# EasyEDA schematic SCH_Tiny_printer_small_2024-12-05.json
TITLE: TinyGB Printer; REV: 1.0; Date: 2024-09-05; Sheet: 1/1; Drawn By: raphael.boichot; Company: Raphaël BOICHOT
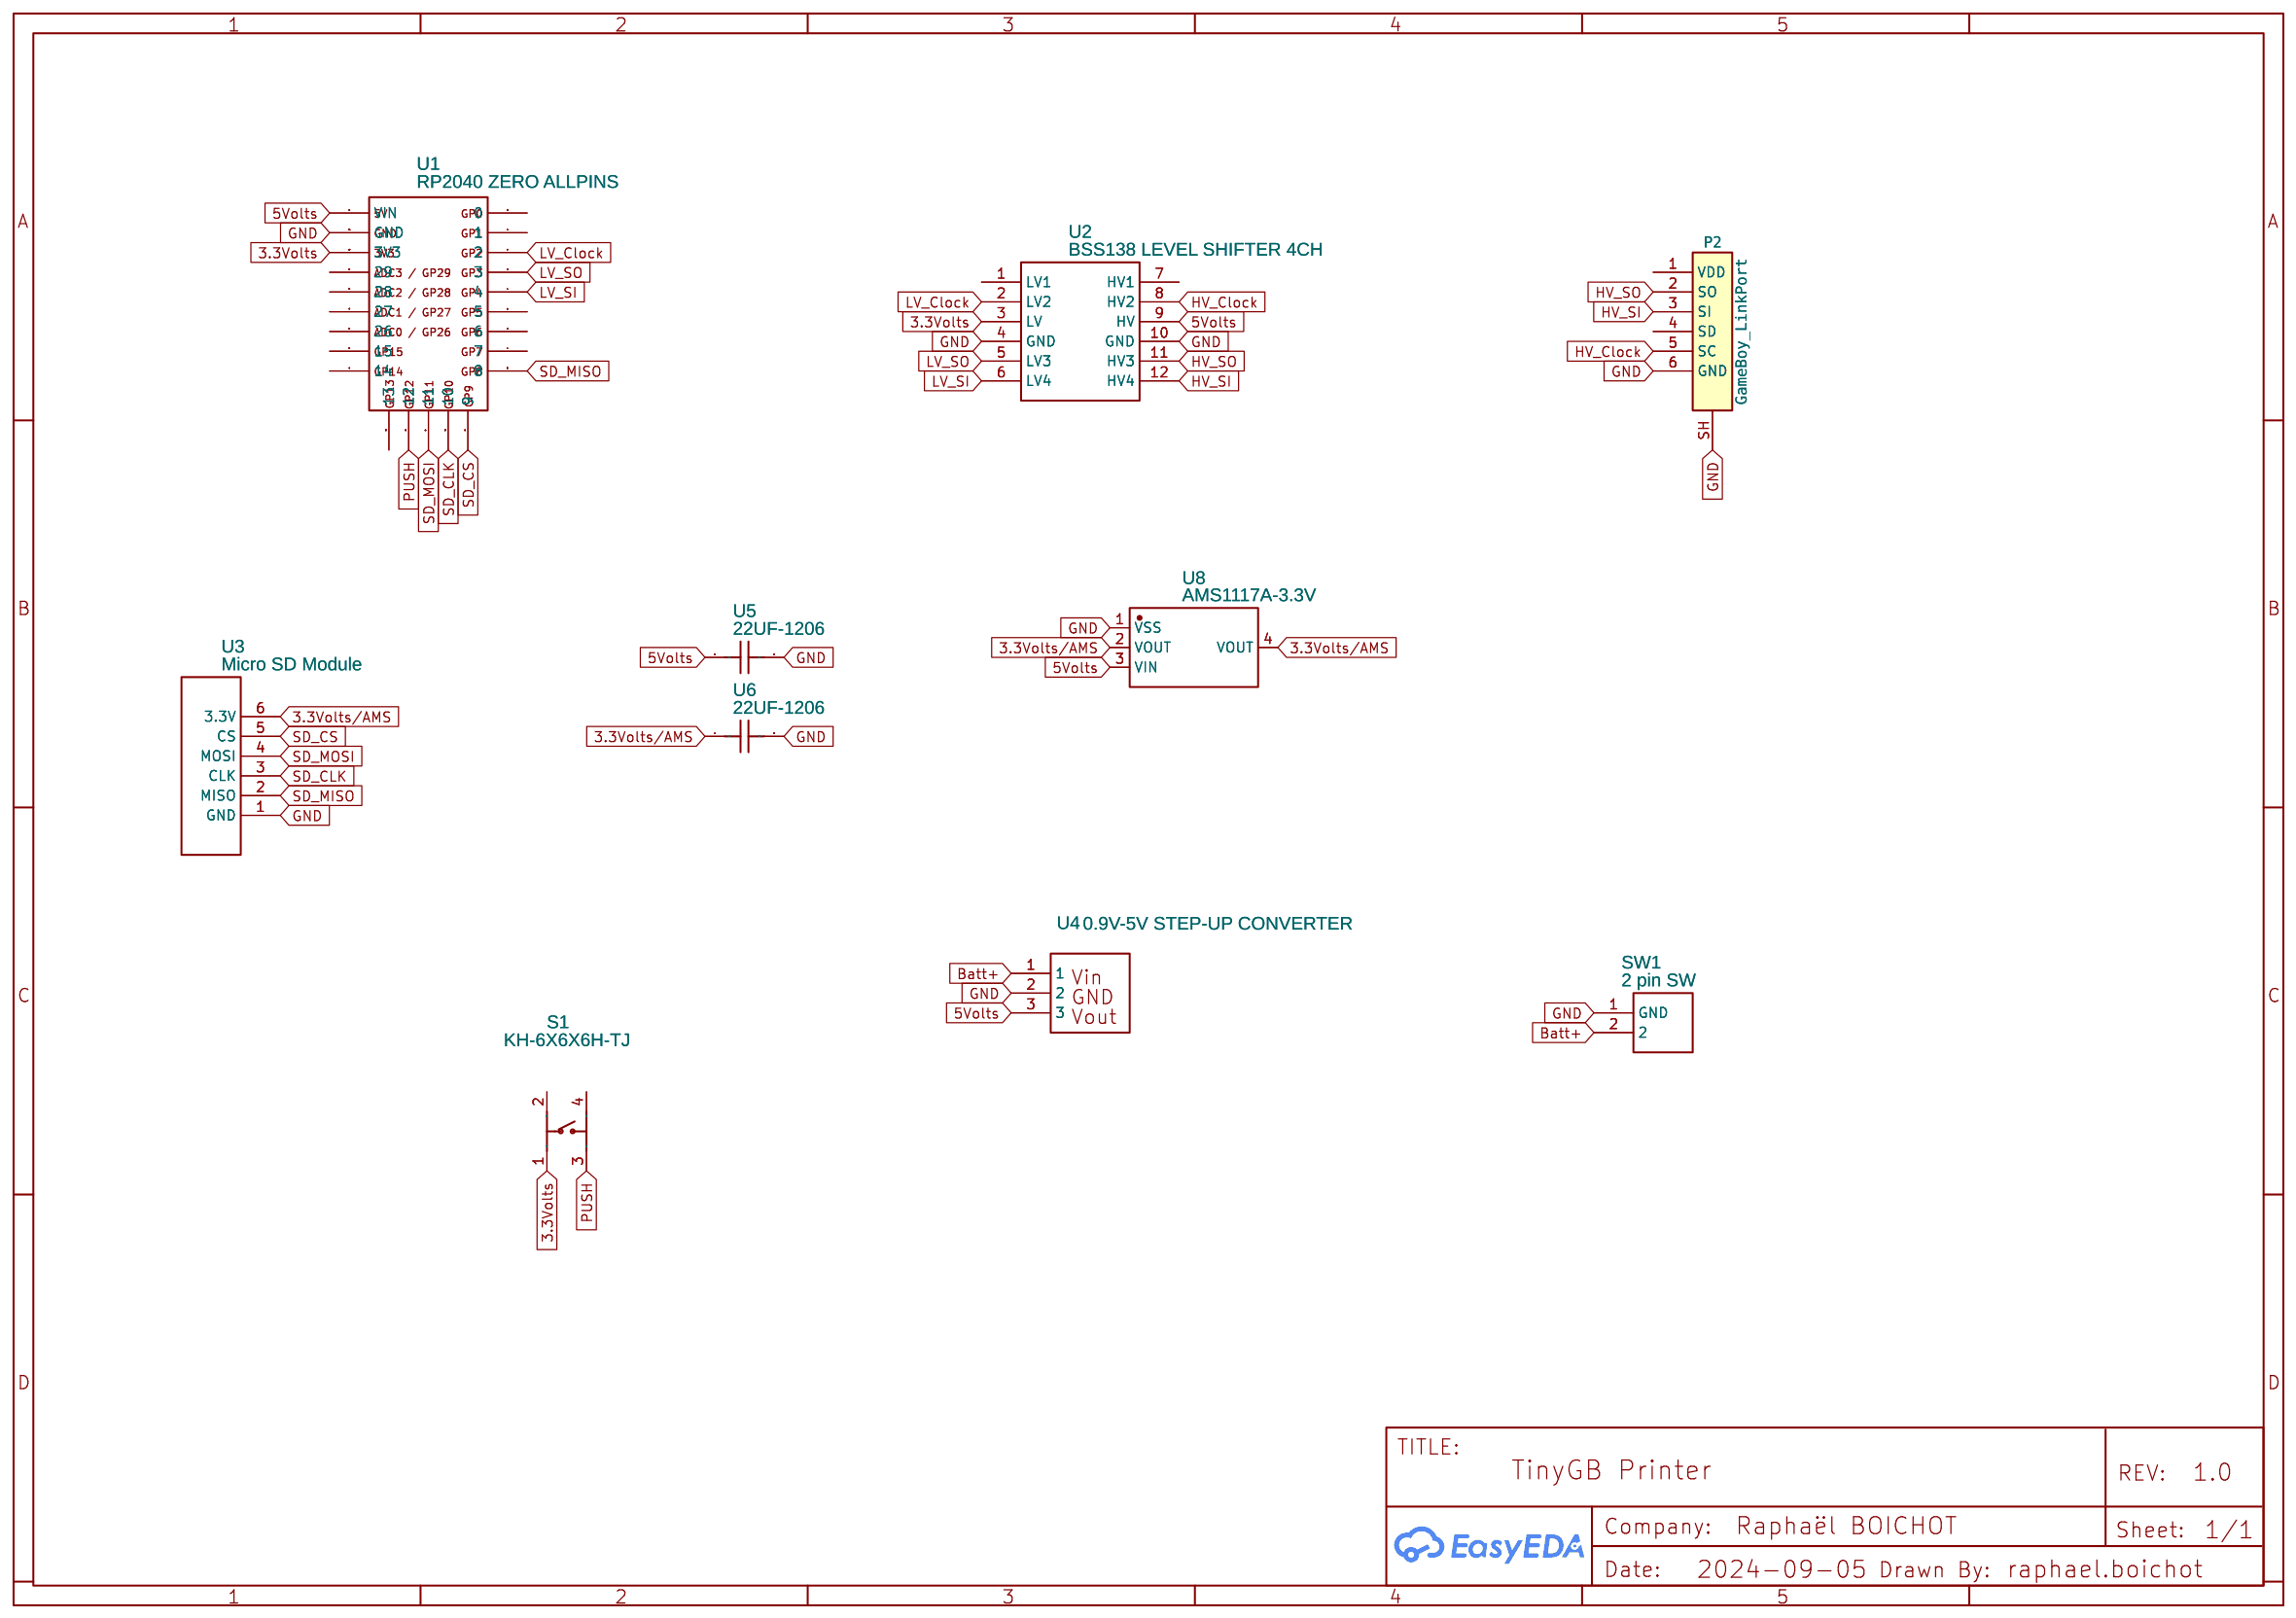
[diagram p0: schematic sheet]

## Parts
P2  GameBoy_LinkPort  [GAMEBOY_LINKPORT_MGB_HORIZONTAL]
S1  KH-6X6X6H-TJ  [SW-TH_4P-L6.0-W6.0-P4.50-LS6.5]
SW1  2 pin SW  [2PINSW]
U1  RP2040 ZERO ALLPINS  [RP2040-ZERO-ALLPINS]
U2  BSS138 LEVEL SHIFTER 4CH  [PKG-BSS138-LEVEL-SHIFTER]
U3  Micro SD Module  [MICRO SD CARD]
U4  0.9V-5V STEP-UP CONVERTER  [0.9V-5V STEP-UP CONVERTER]
U5  22UF-1206  [C1206]
U6  22UF-1206  [C1206]
U8  AMS1117A-3.3V  [SOT-223_L6.3-W3.5-P2.30-LS7.0-BR]

## Library data of the parts
S1 = KH-6X6X6H-TJ: Supplier: LCSC; Supplier Part: C2837516; Manufacturer: kinghelm(金航标); Contributor: LCSC; JLCPCB Part Class: Extended Part
SW1 = 2 pin SW: Manufacturer: NA; Contributor: jbeman
U1 = RP2040 ZERO ALLPINS: Manufacturer: Waveshare; Manufacturer Part: RP2040 Zero; Supplier Part: https://www.waveshare.com/wiki/RP2040-Zero; Supplier: Waveshare; link: https://www.waveshare.com/w/upload/4/4c/RP2040_Zero.pdf; Contributor: teerihalme
U2 = BSS138 LEVEL SHIFTER 4CH: Supplier: futuranet,it; Supplier Part: 7300-LLCONBI; Manufacturer: ON Semiconductor; Manufacturer Part: BSS138; link: http://dlnmh9ip6v2uc.cloudfront.net/datasheets/BreakoutBoards/Logic_Level_Bidirectional.pdf; link2: https://www.onsemi.com/pdf/datasheet/bss138-d.pdf; Contributor: Prof. Ing. F. Scordino
U3 = Micro SD Module: Contributor: alex.baril
U4 = 0.9V-5V STEP-UP CONVERTER: Manufacturer: Generic; Contributor: defultdancin
U5 U6 = 220UF-1206: Contributor: LCSC; Supplier: LCSC; Supplier Part: C9900012040; Manufacturer: null; JLCPCB Part Class: Extended Part
U8 = AMS1117A-3.3V: Contributor: lcsc; Supplier: LCSC; Supplier Part: C2984862; Manufacturer: HX(恒佳兴); JLCPCB Part Class: Extended Part

## Nets
3.3Volts: S1.1 U1.3V3 U2.3(LV)
5Volts: U1.VIN U2.9(HV) U4.3 U5.1 U8.3(VIN)
GND: P2.6(GND) P2.SH SW1.1(GND) U1.GND U2.4(GND) U2.10(GND) U3.1(GND) U4.2 U5.2 U6.2 U8.1(VSS)
3.3Volts/AMS: U3.6(3.3V) U6.1 U8.2(VOUT) U8.4(VOUT)
Batt+: SW1.2 U4.1
HV_Clock: P2.5(SC) U2.8(HV2)
HV_SI: P2.3(SI) U2.12(HV4)
HV_SO: P2.2(SO) U2.11(HV3)
LV_Clock: U1.2 U2.2(LV2)
LV_SI: U1.4 U2.6(LV4)
LV_SO: U1.3 U2.5(LV3)
PUSH: S1.3 U1.12
SD_CLK: U1.10 U3.3(CLK)
SD_CS: U1.9 U3.5(CS)
SD_MISO: U1.8 U3.2(MISO)
SD_MOSI: U1.11 U3.4(MOSI)

Not connected (* = marked no-connect by the designer): P2 1(VDD) 4(SD); S1 2 4; U1 0 1 5 6 7 13 14 15 26 27 28 29; U2 1(LV1) 7(HV1)
